# Altium schematic sheet 05021002_RevisionHistory.SchDoc: Ipê Board
size A4; Organization: Cerebra SC; Address1: R. Coriolano José Gilbertone; Address2: Jd. Paulista; Address3: n° 703; Address4: São Carlos - Brasil; DocumentNumber: 1; Revision: A; SheetNumber: 1; SheetTotal: 8
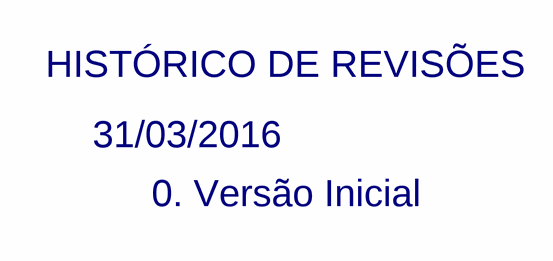
[diagram p0: 05021002_RevisionHistory.SchDoc]

## Notes on the sheet
- HISTÓRICO DE REVISÕES
- 31/03/2016
- 0. Versão Inicial
- Title
- Size:
- Date:
- A4
- Number:
- Time:
- Revision:
- Sheet
- of
- File: